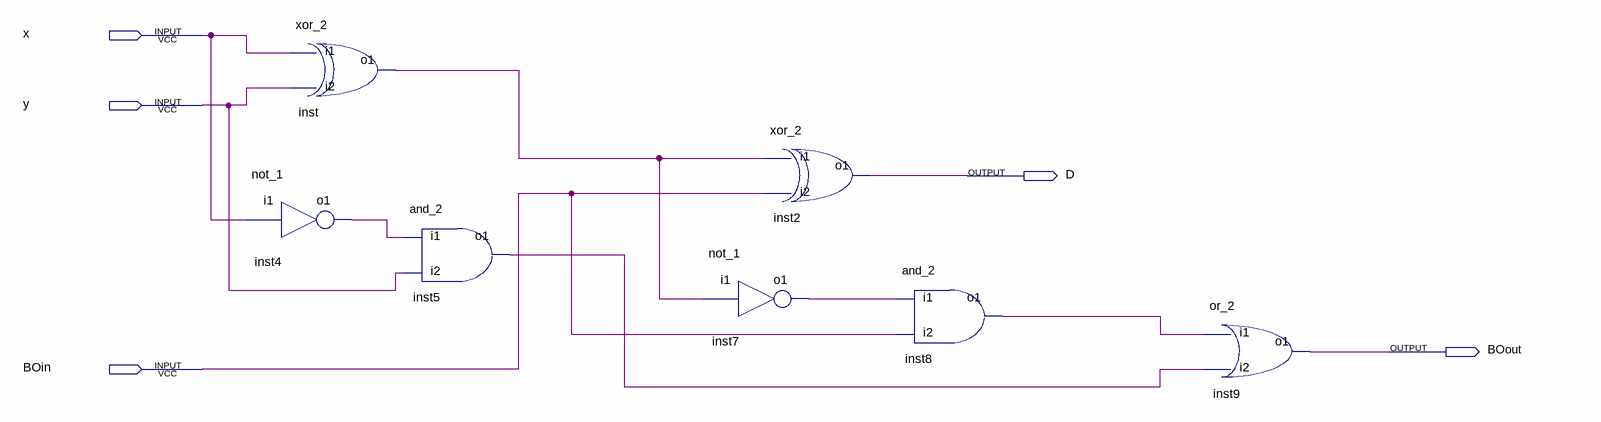
[diagram p0: schematic sheet]
// Quartus schematic FS.bdf as structural Verilog: 7 symbols, 5 pins
module FS (
  input  x,
  input  y,
  input  BOin,
  output D,
  output BOout
);

  wire inst4_o1, inst5_o1, inst7_o1, inst8_o1, inst_o1;

  xor_2 inst (.i1(x), .i2(y), .o1(inst_o1));
  not_1 inst4 (.i1(x), .o1(inst4_o1));
  and_2 inst5 (.i1(inst4_o1), .i2(y), .o1(inst5_o1));
  not_1 inst7 (.i1(inst_o1), .o1(inst7_o1));
  xor_2 inst2 (.i1(inst_o1), .i2(BOin), .o1(D));
  and_2 inst8 (.i1(inst7_o1), .i2(BOin), .o1(inst8_o1));
  or_2 inst9 (.i1(inst8_o1), .i2(inst5_o1), .o1(BOout));
endmodule
